# Altium schematic sheet scheme.SchDoc
size A4
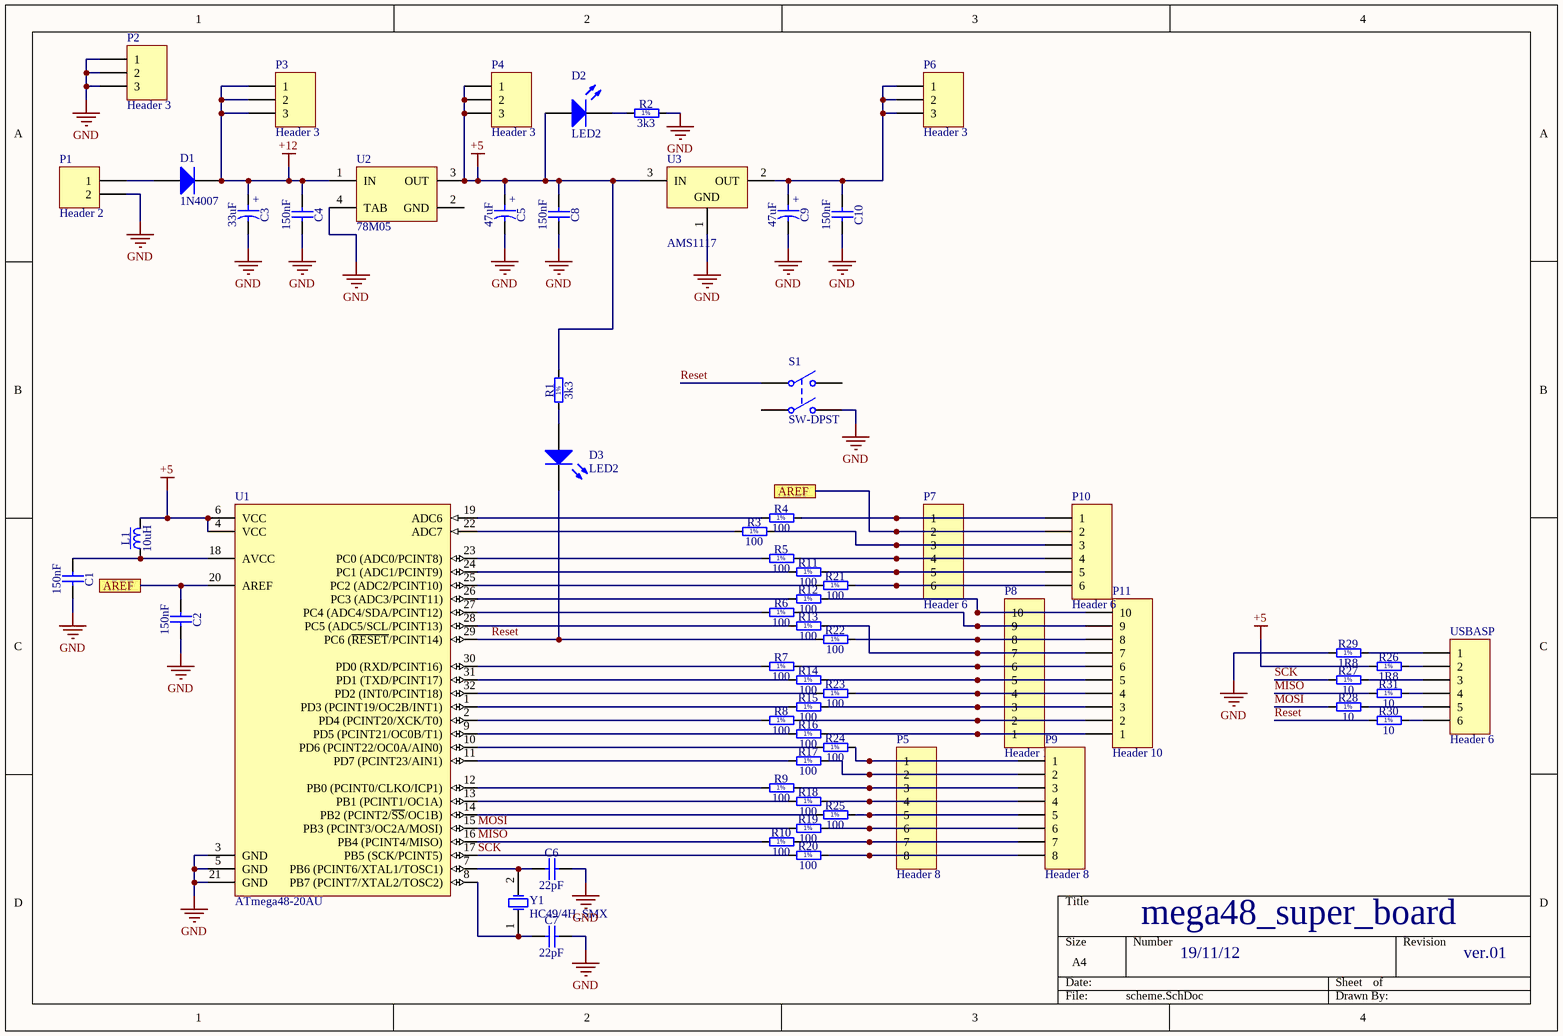
[diagram p0: scheme.SchDoc]

## Parts
C1  150nF  [CAPC2013X100N]
C2  150nF  [CAPC2013X100N]
C3  33uF  [CAPMP7343X310N]
C4  150nF  [CAPC2013X100N]
C5  47uF  [CAPMP6032X280N]
C6  22pF  [CAPC1608X87N]
C7  22pF  [CAPC1608X87N]
C8  150nF  [CAPC2013X100N]
C9  47uF  [CAPMP6032X280N]
C10  150nF  [CAPC2013X100N]
D1  1N4007  [DO-41]
D2  LED2  [6-0805_L]
D3  LED2  [6-0805_L]
L1  10uH  [INDC2012X105N]
P1  Header 2  [HDR1X2]
P2  Header 3  [HDR1X3]
P3  Header 3  [HDR1X3]
P4  Header 3  [HDR1X3]
P5  Header 8  [HDR1X8]
P6  Header 3  [HDR1X3]
P7  Header 6  [HDR1X6]
P8  Header 10  [HDR1X10]
P9  Header 8  [HDR1X8]
P10  Header 6  [HDR1X6]
P11  Header 10  [HDR1X10]
R1  3k3  [RESC2012X60N]
R2  3k3  [RESC2012X60N]
R3  100  [RESC1608X55N]
R4  100  [RESC1608X55N]
R5  100  [RESC1608X55N]
R6  100  [RESC1608X55N]
R7  100  [RESC1608X55N]
R8  100  [RESC1608X55N]
R9  100  [RESC1608X55N]
R10  100  [RESC1608X55N]
R11  100  [RESC1608X55N]
R12  100  [RESC1608X55N]
R13  100  [RESC1608X55N]
R14  100  [RESC1608X55N]
R15  100  [RESC1608X55N]
R16  100  [RESC1608X55N]
R17  100  [RESC1608X55N]
R18  100  [RESC1608X55N]
R19  100  [RESC1608X55N]
R20  100  [RESC1608X55N]
R21  100  [RESC1608X55N]
R22  100  [RESC1608X55N]
R23  100  [RESC1608X55N]
R24  100  [RESC1608X55N]
R25  100  [RESC1608X55N]
R26  1R8  [RESC1608X55N]
R27  10  [RESC1608X55N]
R28  10  [RESC1608X55N]
R29  1R8  [RESC1608X55N]
R30  10  [RESC1608X55N]
R31  10  [RESC1608X55N]
S1  SW-DPST  [DPST-4]
U1  ATmega48-20AU  [32A_N]
U2  78M05  [TS3B_N]
U3  AMS1117  [ADI-KC-3_N]
USBASP  Header 6  [HDR1X6]
Y1  HC49/4H_SMX  [HC49/4H_SMX]

## Ports
AREF

## Nets
+5: C5.1 C8.1 D2.1(A) L1.2 P4.1 P4.2 P4.3 R1.2 R26.1 U1.4(VCC) U1.6(VCC) U2.3(OUT) U3.3(IN)
+12: C3.1 C4.1 D1.2(K) P3.1 P3.2 P3.3 U2.1(IN)
GND: C1.2 C2.2 C3.2 C4.2 C5.2 C6.2 C7.2 C8.2 C9.2 C10.2 P1.2 P2.1 P2.2 P2.3 R2.2 R29.1 S1.4(NO2) U1.3(GND) U1.5(GND) U1.21(GND) U2.4(TAB) U3.1(GND)
AREF: C2.1 P7.2 P10.2 U1.20(AREF) ; port AREF
MISO: R10.1 R31.1 U1.16(PB4_(PCINT4/MISO))
MOSI: R19.1 R28.1 U1.15(PB3_(PCINT3/OC2A/MOSI))
Reset: D3.2(K) R22.1 R30.1 S1.1(COMMON1) U1.29(PC6_(~{RESET}/PCINT14))
SCK: R20.1 R27.1 U1.17(PB5_(SCK/PCINT5))
NetC1_1: C1.1 L1.1 U1.18(AVCC)
NetC6_1: C6.1 U1.7(PB6_(PCINT6/XTAL1/TOSC1)) Y1.2(OSC2)
NetC7_1: C7.1 U1.8(PB7_(PCINT7/XTAL2/TOSC2)) Y1.1(OSC1)
NetC9_1: C9.1 C10.1 P6.1 P6.2 P6.3 U3.2(OUT)
NetD1_1: D1.1(A) P1.1
NetD2_2: D2.2(K) R2.1
NetD3_1: D3.1(A) R1.1
NetP5_1: P5.1 P9.1 R24.2
NetP5_2: P5.2 P9.2 R17.2
NetP5_3: P5.3 P9.3 R9.2
NetP5_4: P5.4 P9.4 R18.2
NetP5_5: P5.5 P9.5 R25.2
NetP5_6: P5.6 P9.6 R19.2
NetP5_7: P5.7 P9.7 R10.2
NetP5_8: P5.8 P9.8 R20.2
NetP7_1: P7.1 P10.1 R4.2
NetP7_3: P7.3 P10.3 R3.2
NetP7_4: P7.4 P10.4 R5.2
NetP7_5: P7.5 P10.5 R11.2
NetP7_6: P7.6 P10.6 R21.2
NetP8_1: P8.1 P11.1 R16.2
NetP8_2: P8.2 P11.2 R8.2
NetP8_3: P8.3 P11.3 R15.2
NetP8_4: P8.4 P11.4 R23.2
NetP8_5: P8.5 P11.5 R14.2
NetP8_6: P8.6 P11.6 R7.2
NetP8_7: P8.7 P11.7 R13.2
NetP8_8: P8.8 P11.8 R22.2
NetP8_9: P8.9 P11.9 R6.2
NetP8_10: P8.10 P11.10 R12.2
NetR3_1: R3.1 U1.22(ADC7)
NetR4_1: R4.1 U1.19(ADC6)
NetR5_1: R5.1 U1.23(PC0_(ADC0/PCINT8))
NetR6_1: R6.1 U1.27(PC4_(ADC4/SDA/PCINT12))
NetR7_1: R7.1 U1.30(PD0_(RXD/PCINT16))
NetR8_1: R8.1 U1.2(PD4_(PCINT20/XCK/T0))
NetR9_1: R9.1 U1.12(PB0_(PCINT0/CLKO/ICP1))
NetR11_1: R11.1 U1.24(PC1_(ADC1/PCINT9))
NetR12_1: R12.1 U1.26(PC3_(ADC3/PCINT11))
NetR13_1: R13.1 U1.28(PC5_(ADC5/SCL/PCINT13))
NetR14_1: R14.1 U1.31(PD1_(TXD/PCINT17))
NetR15_1: R15.1 U1.1(PD3_(PCINT19/OC2B/INT1))
NetR16_1: R16.1 U1.9(PD5_(PCINT21/OC0B/T1))
NetR17_1: R17.1 U1.11(PD7_(PCINT23/AIN1))
NetR18_1: R18.1 U1.13(PB1_(PCINT1/OC1A))
NetR21_1: R21.1 U1.25(PC2_(ADC2/PCINT10))
NetR23_1: R23.1 U1.32(PD2_(INT0/PCINT18))
NetR24_1: R24.1 U1.10(PD6_(PCINT22/OC0A/AIN0))
NetR25_1: R25.1 U1.14(PB2_(PCINT2/~{SS}/OC1B))
NetR26_2: R26.2 USBASP.2
NetR27_2: R27.2 USBASP.3
NetR28_2: R28.2 USBASP.5
NetR29_2: R29.2 USBASP.1
NetR30_2: R30.2 USBASP.6
NetR31_2: R31.2 USBASP.4

Not connected (* = marked no-connect by the designer): S1 2(NO1) 3(COMMON2); U2 2(GND)

## Notes on the sheet
- mega48_super_board
- 19/11/12
- ver.01
- (in symbol CTE6032-28_47UF_10V_10%) +
- (in symbol CTE7343-31_33UF_35V_10%_LESR0300) +
- (in symbol R0603_1R8_1%_0.1W_200PPM) 1%
- (in symbol R0603_10R_1%_0.1W_200PPM) 1%
- (in symbol R0603_100R_1%_0.1W_100PPM) 1%
- (in symbol R0805_3K3_1%_0.125W_100PPM) 1%

## Library data of the parts
C1 C2 C4 C8 C10 = CC0805_150NF_50V_10%_X5R: Non-polarised capacitor; Part Description: SMD Multilayer Chip Ceramic Capacitor; Manufacturer: GENERIC; Manufacturer1 Part Number: C2012X5R1H154K085AA; Voltage: 50V; TC: X5R; Tolerance: ±10%; Part Number: CC0805_150NF_50V_10%_X5R; Component Kind: Standard; Component Type: Standard; Pin Count: 2; Value: 150nF; Status: Not Recommended; Manufacturer Part Number: CC0805_150NF_50V_10%_X5R; Case: 0805; Mounted: Yes; Socket: No; SMD: Yes; Sense: No; Manufacturer1 Example: TDK; Manufacturer1 ComponentHeight: 1mm; HelpURL: \\cern.ch\dfs\Applications\Altium\Datasheets\CC0805_X5R_TDK_C.pdf; Author: CERN DEM JLC; CreateDate: 11.12.2014; LatestRevisionDate: 11.12.2014
C3 = CTE7343-31_33UF_35V_10%_LESR0300: Polarised capacitor; Part Description: Low ESR 0R3 Solid Tantalum Chip Capacitor; Manufacturer: GENERIC; Manufacturer1 Part Number: TPSD336K035R0300; Voltage: 35V; Tolerance: ±10%; Part Number: CTE7343-31_33UF_35V_10%_LESR0300; Component Kind: Standard; Component Type: Standard; Pin Count: 2; Value: 33uF; Status: Preferred; Manufacturer Part Number: CTE7343-31_33UF_35V_10%_LESR0300; Case: D; Mounted: Yes; Socket: No; SMD: Yes; Sense: No; Manufacturer1 Example: AVX; Manufacturer1 ComponentHeight: 3.1mm; HelpURL: \\cern.ch\dfs\Applications\Altium\Datasheets\CTE-LESR_AVX_TPS.pdf; Author: CERN DEM JLC; CreateDate: 05.05.2008; LatestRevisionDate: 20.01.2009
C5 C9 = CTE6032-28_47UF_10V_10%: Polarised capacitor; Part Description: Solid Tantalum Chip Capacitor; Manufacturer: GENERIC; Manufacturer1 Part Number: TAJC476K010RNJ; Voltage: 10V; Tolerance: ±10%; Part Number: CTE6032-28_47UF_10V_10%; Component Kind: Standard; Component Type: Standard; Pin Count: 2; Value: 47uF; Status: Preferred; Manufacturer Part Number: CTE6032-28_47UF_10V_10%; Case: C; Mounted: Yes; Socket: No; SMD: Yes; Sense: No; Manufacturer1 Example: AVX; Manufacturer1 ComponentHeight: 2.8mm; HelpURL: \\cern.ch\dfs\Applications\Altium\Datasheets\CTE_AVX_TAJ.pdf; Author: CERN DEM JLC; CreateDate: 03.07.2013; LatestRevisionDate: 03.07.2013
C6 C7 = CC0603_22PF_50V_5%_NP0: Non-polarised capacitor; Part Description: SMD Multilayer Chip Ceramic Capacitor; Manufacturer: GENERIC; Manufacturer1 Part Number: 223886715229; Voltage: 50V; TC: C0G/NP0; Tolerance: ±5%; Part Number: CC0603_22PF_50V_5%_NP0; Component Kind: Standard; Component Type: Standard; Pin Count: 2; Value: 22pF; Status: Preferred; Manufacturer Part Number: CC0603_22PF_50V_5%_NP0; Case: 0603; Mounted: Yes; Socket: No; SMD: Yes; Sense: No; Manufacturer1 Example: PHYCOMP; Manufacturer1 ComponentHeight: 0.87mm; HelpURL: \\cern.ch\dfs\Applications\Altium\Datasheets\CC0603_NP0_PHYCOMP.pdf; Author: CERN DEM JLC; CreateDate: 03.12.2007; LatestRevisionDate: 03.12.2007
D1 = 1N4007: 1.0 Ampere General Purpose Rectifier; Published: 8-Jun-2000; LatestRevisionDate: 17-Jul-2002; LatestRevisionNote: Re-released for DXP Platform.; DatasheetDocument: 1998; PackageDocument: Aug-1999; PackageReference: DO-41; Publisher: Altium Limited; Code_JEDEC: DO-204-AL; ComponentLink1Description: Manufacturer Link; ComponentLink1URL: http://www.fairchildsemi.com/; ComponentLink2Description: Pinout Specification; ComponentLink2URL: http://www.fairchildsemi.com/ds/1N%2F1N4001.pdf
D2 D3 = LED2: Typical RED, GREEN, YELLOW, AMBER GaAs LED; Published: 8-Jun-2000; LatestRevisionDate: 17-Jul-2002; LatestRevisionNote: Re-released for DXP Platform.; PackageVersion: Feb-2002; PackageReference: 3.2X1.6X1.1; Publisher: Altium Limited; PackageDescription: SM LED; 2 Flat Leads
L1 = IND_10UH_10%_MURATA-PS_8200: Inductor With Core; Part Description: Miniature Surface Mount Power Inductor (8200 Series); Manufacturer: MURATA POWER SOLUTIONS; Manufacturer Part Number: 82103C; Power: 500mA; Resistance: 0.4R; Tolerance: ±10%; Part Number: IND_10UH_10%_MURATA-PS_8200; Component Kind: Standard; Component Type: Standard; Footprint: IND_MURATA-PS_8200; Pin Count: 2; Value: 10uH; Status: None; Mounted: Yes; Socket: No; SMD: Yes; Sense: No; ComponentHeight: 2.3mm; HelpURL: \\cern.ch\dfs\Applications\Altium\Datasheets\IND_MURATA-PS_8200.pdf; Author: CERN DEM JLC; CreateDate: 21.07.2014; LatestRevisionDate: 21.07.2014
P1 = Header 2: Header, 2-Pin; LatestRevisionDate: 17-Jul-2002; LatestRevisionNote: Re-released for DXP Platform.; Publisher: Altium Limited
P2-P4 P6 = Header 3: Header, 3-Pin; LatestRevisionDate: 17-Jul-2002; LatestRevisionNote: Re-released for DXP Platform.; Publisher: Altium Limited
P5 P9 = Header 8: Header, 8-Pin; LatestRevisionDate: 17-Jul-2002; LatestRevisionNote: Re-released for DXP Platform.; Publisher: Altium Limited
P7 P10 USBASP = Header 6: Header, 6-Pin; LatestRevisionDate: 17-Jul-2002; LatestRevisionNote: Re-released for DXP Platform.; Publisher: Altium Limited
P8 P11 = Header 10: Header, 10-Pin; LatestRevisionDate: 17-Jul-2002; LatestRevisionNote: Re-released for DXP Platform.; Publisher: Altium Limited
R1 R2 = R0805_3K3_1%_0.125W_100PPM: Resistor - 1%; Part Description: General Purpose Thick Film Chip Resistor; Manufacturer: GENERIC; Manufacturer1 Part Number: NRC10F3301TRF; Power: 0.125W; TC: ±100ppm/°C; Part Number: R0805_3K3_1%_0.125W_100PPM; Component Kind: Standard; Component Type: Standard; Pin Count: 2; Value: 3k3; Status: Preferred; Tolerance: ±1%; Manufacturer Part Number: R0805_3K3_1%_0.125W_100PPM; Case: 0805; Mounted: Yes; Sense: No; Socket: No; SMD: Yes; Manufacturer1 Example: NIC COMPONENT; Manufacturer1 ComponentHeight: 0.6mm; HelpURL: \\cern.ch\dfs\Applications\Altium\Datasheets\R0805_NIC_NRC.pdf; Author: CERN DEM JLC; CreateDate: 03.12.2007; LatestRevisionDate: 13.03.2008
R3-R25 = R0603_100R_1%_0.1W_100PPM: Resistor - 1%; Part Description: General Purpose Thick Film Chip Resistor; Manufacturer: GENERIC; Manufacturer1 Part Number: NRC06F4700TRF; Power: 0.1W; TC: ±100ppm/°C; Part Number: R0603_100R_1%_0.1W_100PPM; Component Kind: Standard; Component Type: Standard; Pin Count: 2; Value: 100; Status: Preferred; Tolerance: ±1%; Manufacturer Part Number: R0603_100R_1%_0.1W_100PPM; Case: 0603; Mounted: Yes; Sense: No; Socket: No; SMD: Yes; Manufacturer1 Example: NIC COMPONENT; Manufacturer1 ComponentHeight: 0.55mm; HelpURL: \\cern.ch\dfs\Applications\Altium\Datasheets\R0603_NIC_NRC.pdf; Author: CERN DEM JLC; CreateDate: 03.12.2007; LatestRevisionDate: 13.03.2008
R26 R29 = R0603_1R8_1%_0.1W_200PPM: Resistor - 1%; Part Description: General Purpose Thick Film Chip Resistor; Manufacturer: GENERIC; Manufacturer1 Part Number: 232270461808L or RC0603FR-071R8L; Power: 0.1W; TC: ±200ppm/°C; Part Number: R0603_1R8_1%_0.1W_200PPM; Component Kind: Standard; Component Type: Standard; Pin Count: 2; Value: 1R8; Status: Preferred; Tolerance: ±1%; Manufacturer Part Number: R0603_1R8_1%_0.1W_200PPM; Case: 0603; Mounted: Yes; Sense: No; Socket: No; SMD: Yes; Manufacturer1 Example: YAGEO PHYCOMP; Manufacturer1 ComponentHeight: 0.65mm; HelpURL: \\cern.ch\dfs\Applications\Altium\Datasheets\R0603_Phycomp_RC0603.pdf; Author: CERN DEM JLC; CreateDate: 03.12.2007; LatestRevisionDate: 17.10.2012
R27 R28 R30 R31 = R0603_10R_1%_0.1W_200PPM: Resistor - 1%; Part Description: General Purpose Thick Film Chip Resistor; Manufacturer: GENERIC; Manufacturer1 Part Number: NRC06F10R0TRF; Power: 0.1W; TC: ±200ppm/°C; Part Number: R0603_10R_1%_0.1W_200PPM; Component Kind: Standard; Component Type: Standard; Pin Count: 2; Value: 10; Status: Preferred; Tolerance: ±1%; Manufacturer Part Number: R0603_10R_1%_0.1W_200PPM; Case: 0603; Mounted: Yes; Sense: No; Socket: No; SMD: Yes; Manufacturer1 Example: NIC COMPONENT; Manufacturer1 ComponentHeight: 0.55mm; HelpURL: \\cern.ch\dfs\Applications\Altium\Datasheets\R0603_NIC_NRC.pdf; Author: CERN DEM JLC; CreateDate: 03.12.2007; LatestRevisionDate: 24.06.2009
S1 = SW-DPST: Double-Pole, Single-Throw Switch; Published: 24-Mar-1999; LatestRevisionDate: 17-Jul-2002; LatestRevisionNote: Re-released for DXP Platform.; PackageReference: DPST-4; Publisher: Altium Limited; PackageDescription: Switch; 4 Leads
U1 = ATmega48-20AU: 8-bit AVR Microcontroller, 2.7-5.5V, 20MHz, 4KB Flash, 256 Bytes EEPROM, 512 Bytes SRAM, 32-pin TQFP, Industrial Grade (-40°C to 85°C); DatasheetVersion: revT, May-2011; PackageVersion: revC, Oct-2010; PackageReference: 32A; PackageDescription: 32-Lead, 7x7x1.0 mm Body, 0.8mm Lead Pitch, Thin Profile Plastic Quad Flat Package (TQFP); Code_JEDEC: MS-026-ABA; ComponentLink1Description: Manufacturer URL; ComponentLink1URL: http://www.atmel.com/; ComponentLink2Description: ATmega48/88/168 Datasheet; ComponentLink2URL: http://www.atmel.com/dyn/resources/prod_documents/doc2545.pdf; ComponentLink3Description: ATmega48/88/168 Summary; ComponentLink3URL: http://www.atmel.com/dyn/resources/prod_documents/2545S.pdf
U2 = LM340S-5.0: Series 3-Terminal Positive Regulators, 3-pin TO-263; Manufacturer: National Semiconductor; PackageTopMarking: NSUZXYTTE#*LM340S*-5.0 P+; PowerWise: N; CompType: LDO IC; High-Reliability: Y; DatasheetVersion: Jul-2006; PackageVersion: revF, Apr-2005; PackageReference: TS3B; PackageDescription: TO-263, Molded, .400 x .390 x .180in, 3 Lead, .1in Pitch, Surface Mount; PartNumber: LM340S-5.0; RoHS: N; PinCount: 3; Code_JEDEC: MO-169-AA; ComponentLink1Description: Manufacturer URL; ComponentLink1URL: http://www.national.com/; ComponentLink2Description: LM340 Datasheet; ComponentLink2URL: http://www.national.com/ds/LM/LM340.pdf; ComponentLink3Description: LM340 Web Page; ComponentLink3URL: http://www.national.com/pf/LM/LM340.html; ComponentLink4Description: TS3B Package Page; ComponentLink4URL: http://www.national.com/packaging/folders/ts3b.html
U3 = ADP3338AKCZ-3.3-RL: High Accuracy, Ultralow IQ, 1 A, anyCAP(R) Low Dropout Regulator, 2.7 to 8 V Vin, 3.3 V Vout, Industrial, 3-pin SOT223 (KC-3), Reel; Manufacturer: Analog Devices; Iout max: 1A; Preset Vout Values (V): 3.3; Supply Current IGND @ Small Load: 110uA; Vin (max) (V): 8; Vin (min) (V): 2.7; DatasheetVersion: Rev. B; PackageVersion: 11-20-2012-B, 11/2012; PackageReference: KC-3; PackageDescription: 3-Pin Small Outline Transistor Package, Body 3.5 x 6.5 mm, Pitch 2.3 mm; Supplier 1: Digi-Key; Supplier Part Number 1: ADP3338AKCZ-3.3-RLTR-ND; Supplier 2: Digi-Key; Supplier Part Number 2: ADP3338AKCZ-3.3-RLCT-ND; Supplier 3: Digi-Key; Supplier Part Number 3: ADP3338AKCZ-3.3-RLDKR-ND; Supplier 4: Newark; Supplier Part Number 4: 59K2619; Supplier 5: Mouser; Supplier Part Number 5: 584-ADP3338AKCZ3.3R; Packing: Reel; Mounting Technology: Surface Mount; Code_JEDEC: TO-261-AA; PartNumber: ADP3338AKCZ-3.3-RL; ComponentLink1Description: Manufacturer URL; ComponentLink1URL: http://www.analog.com/en/index.html; ComponentLink2Description: Datasheet; ComponentLink2URL: http://www.analog.com/static/imported-files/data_sheets/ADP3338.pdf; ComponentLink3Description: Package Specification; ComponentLink3URL: http:/www.analog.com/static/imported-files/packages/PKG_PDF/SOT_223(KC)/KC_3.pdf; ComponentLink4Description: URL Link1; ComponentLink4URL: Product URL:http://www.analog.com/en/ADP3338/productSearch.html
Y1 = HC49/4H_SMX: Surface Mount Quartz Crystal; Note: PCB layout complies with manufacturer's recommendation.; Published: 17-Jul-2002; DatasheetDocument: 18-Oct-1999; PackageDocument: 18-Oct-1999; PackageReference: HC49/4H_SMX; Publisher: Altium Limited; ComponentLink1Description: Manufacturer Link; ComponentLink1URL: http://www.cmac.com/mt/; ComponentLink2Description: Datasheet; ComponentLink2URL: http://www.cmac.com/mt/databook/crystals/smd/hc49_4h_smx.pdf